# Altium schematic sheet MicroController.SchDoc: Teknofest Project
size 381 x 241 mm; Date: 21/12/2023; SheetNumber: 2; SheetTotal: 4; Prepared by: Mustafa Oğuz Ateş
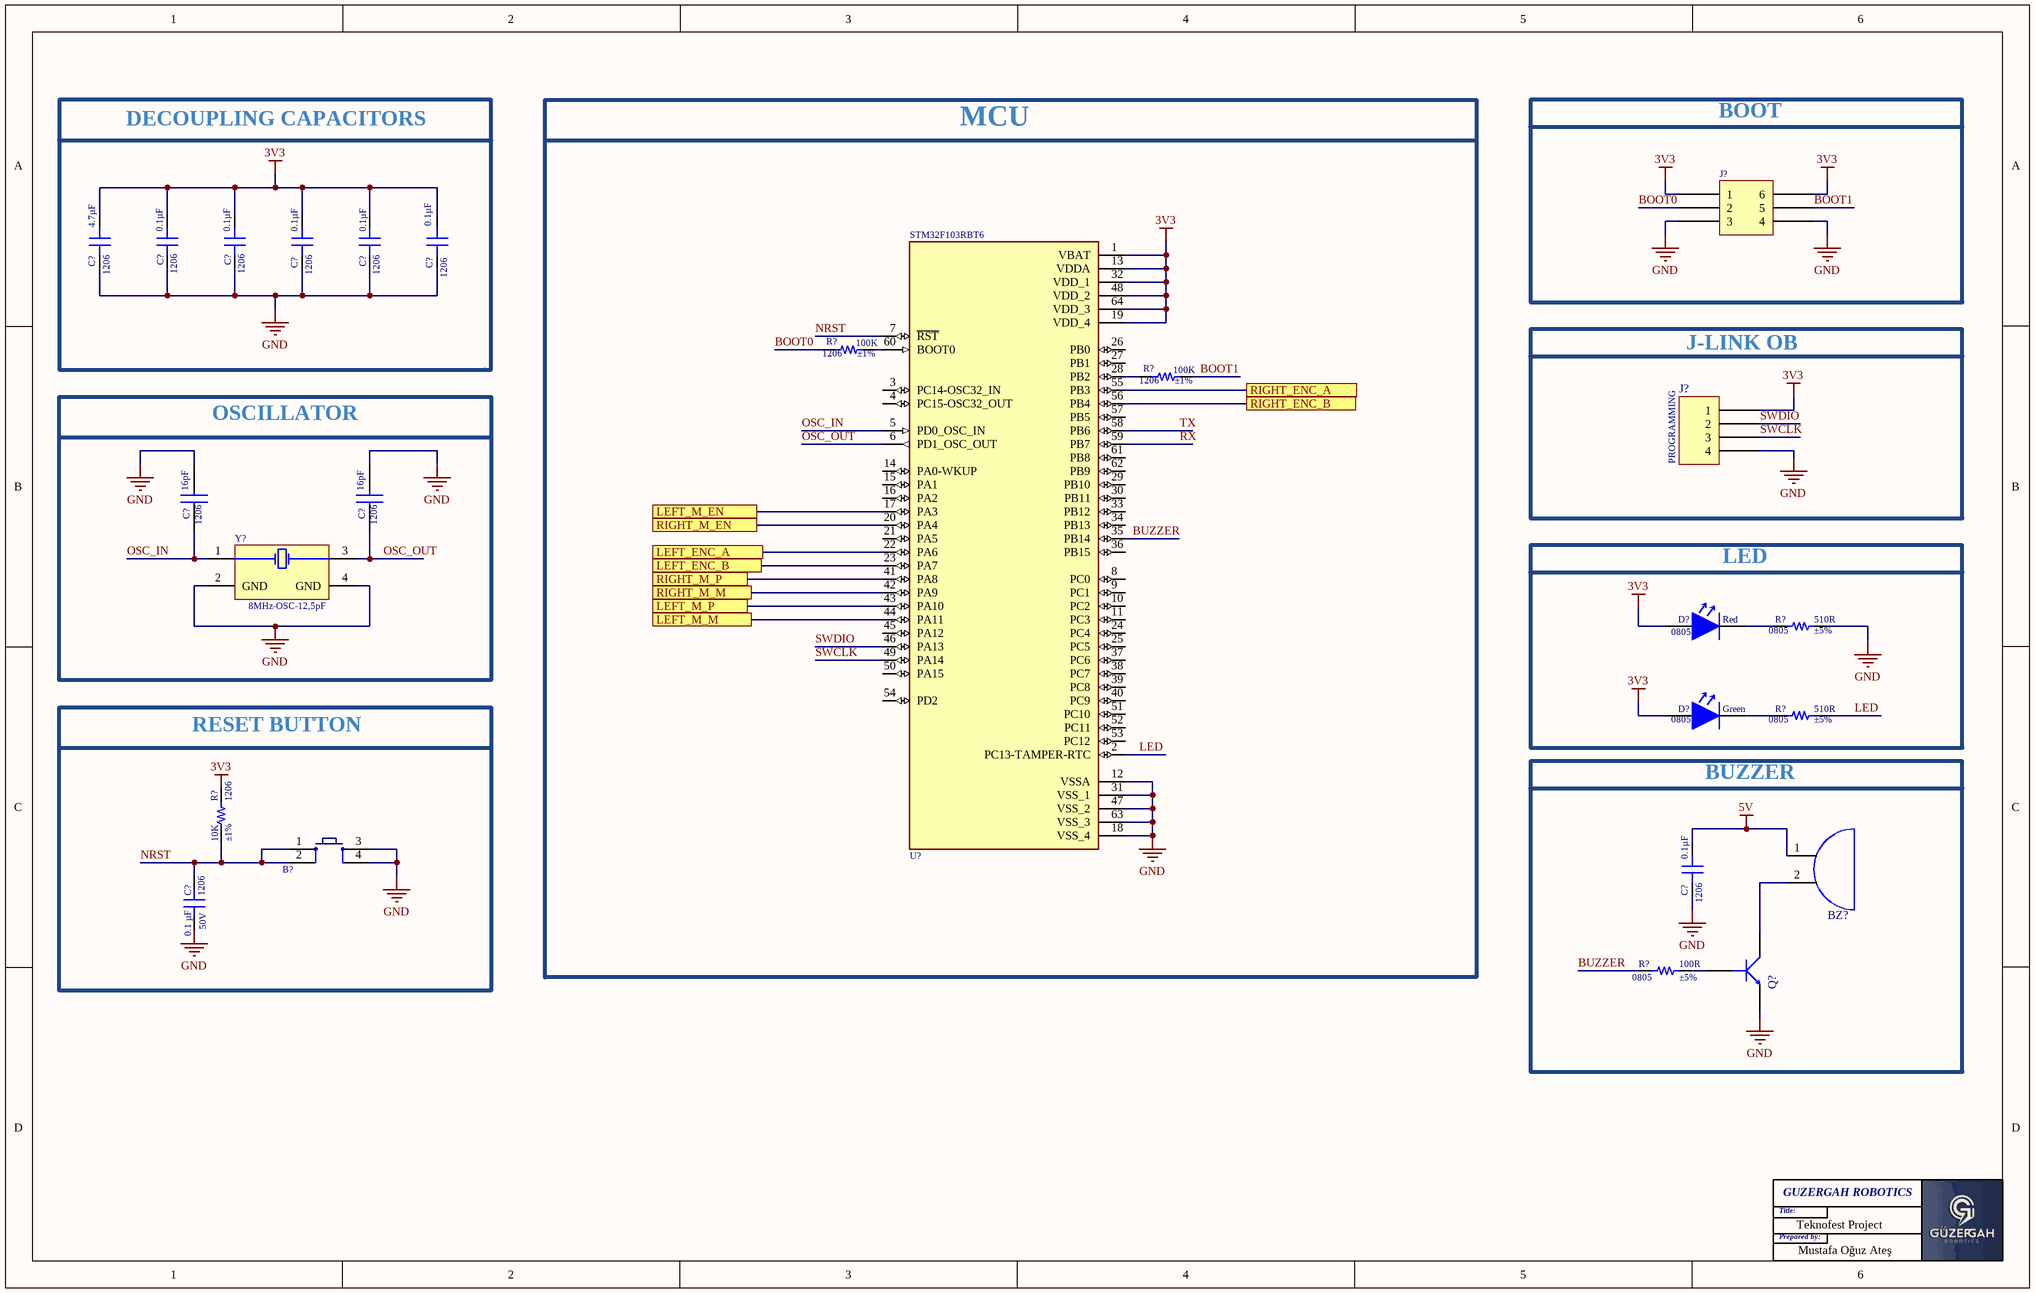
[diagram p0: MicroController.SchDoc]

## Parts
(Parts that share a designator on the sheet are numbered #1, #2 ... from top to bottom, then left to right.)
B?  Push Button  [PUSB BUTTON-SMD]  (value not drawn)
BZ?  CMI-9605IC-0580T  [CMI-9605IC]  (value not drawn)
C?#1  Package / Case: 1206  [CAP 1206_3216 - 1.0MM]  (hidden comment: 4.7µF)
C?#2  Package / Case: 1206  [CAP 1206_3216 - 1.0MM]  (hidden comment: 0.1µF)
C?#3  Package / Case: 1206  [CAP 1206_3216 - 1.0MM]  (hidden comment: 0.1µF)
C?#4  Package / Case: 1206  [CAP 1206_3216 - 1.0MM]  (hidden comment: 0.1µF)
C?#5  Package / Case: 1206  [CAP 1206_3216 - 1.0MM]  (hidden comment: 0.1µF)
C?#6  Package / Case: 1206  [CAP 1206_3216 - 1.0MM]  (hidden comment: 0.1µF)
C?#7  Parameter 1: 16pF  Device Package: 1206  [CAP_1206]
C?#8  Parameter 1: 16pF  Device Package: 1206  [CAP_1206]
C?#9  Package / Case: 1206  [CAP 1206_3216 - 1.0MM]  (hidden comment: 0.1µF)
C?#10  Package / Case: 1206  Voltage - Rated: 50V  [CAP 1206_3216 - 0.8MM]  (hidden comment: 0.1 µF)
D?#1  Color: Red  Case Code (Imperial): 0805  [LED_RED_0805]  (hidden comment: LH R974-LP-1)
D?#2  Case/Package: 0805  Color: Green  [LED_GREEN_0805]  (hidden comment: LTST-C171GKT)
J?#1  M20-7830342  [HARWIN M20-7830345]  (value not drawn)
J?#2  M20-7820442  [HARWIN M20-7820445]  (value not drawn)
Q?  MMBT3904-7-F  [SOT-23F]  (value not drawn)
R?#1  100K  Supplier Device Package: 1206  Tolerance: ±1%  [RES 1206_3216]
R?#2  100K  Supplier Device Package: 1206  Tolerance: ±1%  [RES 1206_3216]
R?#3  Supplier Device Package: 0805  Tolerance: ±5%  [RES 0805_2012]  (hidden comment: 510R)
R?#4  Supplier Device Package: 0805  Tolerance: ±5%  [RES 0805_2012]  (hidden comment: 510R)
R?#5  10K  Supplier Device Package: 1206  Tolerance: ±1%  [RES 1206_3216]
R?#6  Package / Case: 0805  Tolerance: ±5%  [RES 0805_2012]  (hidden comment: 100R)
U?  STM32F103RBT6  [LQFP-64]
Y?  8MHz-OSC-12,5pF  [8MHz-OSC]

## Blocks framed on the sheet
DECOUPLING CAPACITORS: C?#1-C?#6
BOOT: J?#1
MCU: R?#1 R?#2 U?
J-LINK OB: J?#2
LED: D?#1 D?#2 R?#3 R?#4
BUZZER: BZ? C?#9 Q? R?#6

## Ports
LEFT_ENC_A, LEFT_ENC_B, LEFT_M_EN, LEFT_M_M, LEFT_M_P, RIGHT_ENC_A, RIGHT_ENC_B, RIGHT_M_EN, RIGHT_M_M, RIGHT_M_P

## Nets
3V3: C?#1.2 C?#2.2 C?#3.2 C?#4.2 C?#5.2 C?#6.2 D?#1.2 D?#2.2 J?#1.1 J?#1.6 J?#2.1 R?#5.2 U?.1(VBAT) U?.13(VDDA) U?.19(VDD_4) U?.32(VDD_1) U?.48(VDD_2) U?.64(VDD_3)
5V: BZ?.1 C?#9.2
GND: B?.3 B?.4 C?#1.1 C?#2.1 C?#3.1 C?#4.1 C?#5.1 C?#6.1 C?#7.2 C?#8.2 C?#9.1 C?#10.2 J?#1.3 J?#1.4 J?#2.4 Q?.2(E) R?#3.2 U?.12(VSSA) U?.18(VSS_4) U?.31(VSS_1) U?.47(VSS_2) U?.63(VSS_3) Y?.2(GND) Y?.4(GND)
BOOT0: J?#1.2 R?#1.2
BOOT1: J?#1.5 R?#2.1
BUZZER: R?#6.1 U?.35(PB14)
LED: R?#4.2 U?.2(PC13-TAMPER-RTC)
LEFT_ENC_A: U?.22(PA6) ; port LEFT_ENC_A
LEFT_ENC_B: U?.23(PA7) ; port LEFT_ENC_B
LEFT_M_EN: U?.17(PA3) ; port LEFT_M_EN
LEFT_M_M: U?.44(PA11) ; port LEFT_M_M
LEFT_M_P: U?.43(PA10) ; port LEFT_M_P
NRST: B?.1 B?.2 C?#10.1 R?#5.1 U?.7(~{RST})
OSC_IN: C?#7.1 U?.5(PD0_OSC_IN) Y?.1(Tristate)
OSC_OUT: C?#8.1 U?.6(PD1_OSC_OUT) Y?.3(OUT)
RIGHT_ENC_A: U?.55(PB3) ; port RIGHT_ENC_A
RIGHT_ENC_B: U?.56(PB4) ; port RIGHT_ENC_B
RIGHT_M_EN: U?.20(PA4) ; port RIGHT_M_EN
RIGHT_M_M: U?.42(PA9) ; port RIGHT_M_M
RIGHT_M_P: U?.41(PA8) ; port RIGHT_M_P
RX: U?.59(PB7)
SWCLK: J?#2.3 U?.49(PA14)
SWDIO: J?#2.2 U?.46(PA13)
TX: U?.58(PB6)
NetBZ?_2: BZ?.2 Q?.3(C)
NetD?#1_1: D?#1.1 R?#3.1
NetD?#2_1: D?#2.1 R?#4.1
NetQ?_1: Q?.1(B) R?#6.2
NetR?#1_1: R?#1.1 U?.60(BOOT0)
NetR?#2_2: R?#2.2 U?.28(PB2)

Not connected (* = marked no-connect by the designer): U? 3(PC14-OSC32_IN) 4(PC15-OSC32_OUT) 8(PC0) 9(PC1) 10(PC2) 11(PC3) 14(PA0-WKUP) 15(PA1) 16(PA2) 21(PA5) 24(PC4) 25(PC5) 26(PB0) 27(PB1) 29(PB10) 30(PB11) 33(PB12) 34(PB13) 36(PB15) 37(PC6) 38(PC7) 39(PC8) 40(PC9) 45(PA12) 50(PA15) 51(PC10) 52(PC11) 53(PC12) 54(PD2) 57(PB5) 61(PB8) 62(PB9)

## Notes on the sheet
- OSCILLATOR
- (near J?#2) PROGRAMMING
- RESET BUTTON
- Title:
- Prepared by:
- GUZERGAH ROBOTICS

## Library data of the parts
B? = Push Button: Smd Push Button; Satın Alma Linki: https://urun.n11.com/diger/mini-pushbutton-switch-smd-P227461537?gclid=Cj0KCQjwkoDmBRCcARIsAG3xzl8Y_-jeD7HocNM6lvuZ_rVp83568XPGtNzlPwXWLph8oCRqo0yh87UaApZYEALw_wcB&gclsrc=aw.ds
BZ? = CMI-9605IC-0580T: Audio Buzzer Magnetic 3VDC 7VDC 30mA 5VDC 85dB 2600Hz to 2800Hz Through Hole Pin Box; Manufacturer: CUI Devices; Designed by: Mustafa; Supplier: Digi-Key; Supplier Part Number: 2223-CMI-9605IC-0580T-ND; Manufacturer Part Number: CMI-9605IC-0580T; RoHS: No; Category: Audio Products; Stock: 5910; Pricing: 1=1,22, 10=1,014, 25=0,938, 50=0,883, 100=0,8298, 250=0,76976, 500=0,71396, 1000=0,66741, 5000=0,65403 (USD); Case/Package: CMI-9605IC
C?#1 = 1206ZC475MAT2A: CAP CER 4.7UF 10V X7R 1206; manufacturer: AVX Corporation; Tolerance: ±20%; Part Number: 1206ZC475MAT2A; Value: 4.7µF; Applications: General Purpose; Capacitance: 4.7µF; componentlink1description: Datasheet; componentlink1url: http://datasheets.avx.com/X7RDielectric.pdf; componentlink2description: DigiKey Link; componentlink2url: http://digikey.com/product-detail/en/avx-corporation/1206ZC475MAT2A/478-12250-1-ND/9565657; Device Package: 1206 (3216 Metric); lastupdated: 2.09.2020 01:05:04; Lifecycle Status: Active; Minimum Order: 1; Mounting Type: Surface Mount, MLCC; Operating Temperature: -55°C ~ 125°C; packaging: TapeAndReel; partid: 19450; Part Status: Active; price: 0.08; series: -; Size / Dimension: 0.126" L x 0.063" W (3.20mm x 1.60mm); Supplier 1: DigiKey; Supplier Part Number 1: 478-12250-1-ND; Temperature Coefficient: X7R; Thickness (Max): 0.037" (0.94mm); Voltage - Rated: 10V
C?#2-C?#6 C?#9 = 1206ZC475MAT2A: CAP CER 4.7UF 10V X7R 1206; manufacturer: AVX Corporation; Capacitance: 40.1µF; Tolerance: ±20%; Part Number: 1206ZC475MAT2A; Value: 0.1µF; Applications: General Purpose; componentlink1description: Datasheet; componentlink1url: http://datasheets.avx.com/X7RDielectric.pdf; componentlink2description: DigiKey Link; componentlink2url: http://digikey.com/product-detail/en/avx-corporation/1206ZC475MAT2A/478-12250-1-ND/9565657; Device Package: 1206 (3216 Metric); lastupdated: 2.09.2020 01:05:04; Lifecycle Status: Active; Minimum Order: 1; Mounting Type: Surface Mount, MLCC; Operating Temperature: -55°C ~ 125°C; packaging: TapeAndReel; partid: 19450; Part Status: Active; price: 0.08; series: -; Size / Dimension: 0.126" L x 0.063" W (3.20mm x 1.60mm); Supplier 1: DigiKey; Supplier Part Number 1: 478-12250-1-ND; Temperature Coefficient: X7R; Thickness (Max): 0.037" (0.94mm); Voltage - Rated: 10V
C?#7 C?#8 = CAP CER 16pF 1206: Value: 16pF; Capacitance: 16pF
C?#10 = CC1206MRY5V9BB104: CAP CER 0.1UF 50V Y5V 1206; manufacturer: Yageo; Temperature Coefficient: Y5V (F); Tolerance: ±20%; Part Number: CC1206MRY5V9BB104; Value: 0.1 µF; Applications: General Purpose; Capacitance: 0.1 µF; componentlink1description: Datasheet; componentlink1url: http://www.yageo.com/documents/recent/UPY-GPHC_Y5V_6.3V-to-50V_8.pdf; componentlink2description: DigiKey Link; componentlink2url: https://www.digikey.com/en/products/detail/yageo/CC1206MRY5V9BB104/5884674; Device Package: 1206 (3216 Metric); lastupdated: 24.12.2023 20:16:49; Lifecycle Status: Active; Minimum Order: 1; Mounting Type: Surface Mount, MLCC; Operating Temperature: -30°C ~ 85°C; packaging: TapeAndReel; partid: 18711; Part Status: Active; price: 0.04; series: CC; Size / Dimension: 0.126" L x 0.063" W (3.20mm x 1.60mm); Supplier 1: DigiKey; Supplier Part Number 1: 311-4504-1-ND; Thickness (Max): 0.028" (0.70mm)
D?#1 = LED RED 0805: LED Uni-Color Hyper Red 660nm 2-Pin Chip 0805(2012Metric) T/R; Manufacturer: Osram Opto; Lens Color: White; Forward Voltage: 1.8V; Lens Style: Diffused,Flat,Colorless; Luminous Intensity: 71mcd; Viewing Angle: 160°; Forward Current: 30mA; Dominant Wavelength: 645nm; Number of Elements: 1; Test Current: 20mA; Reverse Voltage: 5V; Lens Transparency: Diffused; Luminous Flux: 0.17lm; Lens Size: 1.25mm; Designed by: Mustafa; Supplier 1: Digi-Key; Manufacturer Part Number: LH R974-LP-1; RoHS: Yes; Category: LEDs; Stock 1: 35632; Pricing 1: 1=0,26000, 10=0,13900, 100=0,06480, 500=0,05978, 1000=0,04683, 2000=0,04584 (USD); Mount: Surface Mount; Case/Package: 0805; Number of Pins: 2; Case Code (Metric): 2012; Min Operating Temperature: -30°C; Max Operating Temperature: 85°C; Packaging: Tape and Reel; Illumination Color: Red; Package Quantity: 1; Series: CHipLED; Length: 2.1mm; Width: 1.25mm; Depth: 1.35mm; Radiation Hardening: No; RoHS Compliant: Yes; ComponentLink1URL: http://www.jameco.com/Jameco/Products/ProdDS/2085634.pdf?src-supplier=Jameco; ComponentLink1Description: http://www.jameco.com/Jameco/Products/ProdDS/2085634.pdf?src-supplier=Jameco; ComponentLink2URL: http://components.arrow.com/part/dataview/0323_01825492?src-supplier=Arrow+Europe; ComponentLink2Description: http://components.arrow.com/part/dataview/0323_01825492?src-supplier=Arrow+Europe; ComponentLink3URL: https://dammedia.osram.info/media/resource/hires/osram-dam-2493888/LH%20R974.pdf?src-supplier=Digi-Key; ComponentLink3Description: https://dammedia.osram.info/media/resource/hires/osram-dam-2493888/LH%20R974.pdf?src-supplier=Digi-Key; ComponentLink4URL: http://www.mouser.com/ds/2/311/LH%20R974%20-%20CHIPLED%200805-318659.pdf?src-supplier=Mouser; ComponentLink4Description: http://www.mouser.com/ds/2/311/LH%20R974%20-%20CHIPLED%200805-318659.pdf?src-supplier=Mouser; ComponentLink5URL: https://www.verical.com/server-webapp/html/getDatasheet?partID=258950&src-supplier=Verical; ComponentLink5Description: https://www.verical.com/server-webapp/html/getDatasheet?partID=258950&src-supplier=Verical; ComponentLink6URL: http://components.arrow.com/part/dataview/41971690S1077610N9133?src-supplier=Arrow+Electronics; ComponentLink6Description: http://components.arrow.com/part/dataview/41971690S1077610N9133?src-supplier=Arrow+Electronics; ComponentLink7URL: http://components.arrow.com/part/dataview/41971690S6190115N2128?src-supplier=Arrow+Electronics; ComponentLink7Description: http://components.arrow.com/part/dataview/41971690S6190115N2128?src-supplier=Arrow+Electronics; Supplier Part Number 1: 475-1415-1-ND
D?#2 = LED GREEN 0805: Green 0805 130 º Min 5 mcd Typical 12 mcd Water Clear Lens SMT LED; Manufacturer: Vishay Lite-On; Designed by: Mustafa; Lens Color: Colorless; Viewing Angle: 130°; Lens Style: Diffused,Colorless,Rectangular,Clear; Luminous Intensity: 12mcd; Forward Current: 30mA; Forward Voltage: 2.1V; Power Rating: 100mW; Dominant Wavelength: 569nm; Test Current: 10mA; Number of Elements: 1; Wavelength: 585nm; Reverse Voltage: 5V; Supplier 1: Digi-Key; Manufacturer Part Number: LTST-C171GKT; RoHS: Yes; Category: LEDs; Stock 1: 159023; Pricing 1: 1=0,26000, 10=0,14100, 100=0,06560, 500=0,06060, 1000=0,04747 (USD); Mount: Surface Mount; Number of Pins: 2; Case Code (Metric): 2012; Case Code (Imperial): 0805; Min Operating Temperature: -55°C; Max Operating Temperature: 85°C; Package Quantity: 1; Packaging: Tape and Reel; Illumination Color: Green; Lens Transparency: Clear; Power Dissipation: 100mW; Number of LEDs: 1; Series: CHIPLED 0805; Length: 2mm; Width: 1.25mm; Height: 0.8mm; Depth: 1.25mm; Radiation Hardening: No; Lead Free: Lead Free; RoHS Compliant: Yes; ComponentLink1URL: https://datasheet.ciiva.com/2110/ltst-c171gkt-2110000.pdf?src-supplier=Digi-Key; ComponentLink1Description: https://datasheet.ciiva.com/2110/ltst-c171gkt-2110000.pdf?src-supplier=Digi-Key; ComponentLink2URL: https://datasheet.ciiva.com/11773/0900766b80dc0296-11773991.pdf?src-supplier=RSComponents; ComponentLink2Description: https://datasheet.ciiva.com/11773/0900766b80dc0296-11773991.pdf?src-supplier=RSComponents; ComponentLink3URL: https://datasheet.ciiva.com/12400/lite-on-ltst-c171gkt-190133-12400647.pdf?src-supplier=Mouser; ComponentLink3Description: https://datasheet.ciiva.com/12400/lite-on-ltst-c171gkt-190133-12400647.pdf?src-supplier=Mouser; ComponentLink4URL: https://datasheet.ciiva.com/2110/ltst-c171gkt-2110001.pdf?src-supplier=Digi-Key; ComponentLink4Description: https://datasheet.ciiva.com/2110/ltst-c171gkt-2110001.pdf?src-supplier=Digi-Key; ComponentLink5URL: https://datasheet.ciiva.com/2110/ltst-c171gkt-2110002.pdf?src-supplier=Digi-Key; ComponentLink5Description: https://datasheet.ciiva.com/2110/ltst-c171gkt-2110002.pdf?src-supplier=Digi-Key; ComponentLink6URL: https://datasheet.ciiva.com/16396/ltst-c171gkt-16396549.pdf?src-supplier=Future+Electronics; ComponentLink6Description: https://datasheet.ciiva.com/16396/ltst-c171gkt-16396549.pdf?src-supplier=Future+Electronics; Supplier Part Number 1: 160-1423-1-ND
J?#1 = M20-7830342: CONN RCPT 6POS 0.1 GOLD PCB; Part Number: M20-7830342
J?#2 = M20-7820442: CONN RCPT 4POS 0.1 GOLD PCB; Part Number: M20-7820442
Q? = MMBT3904-7-F: Transistor General Purpose BJT NPN 40 Volt 0.2A Automotive 3-Pin SOT-23; Manufacturer: Diodes Zetex; Designed by: BERK; Max Power Dissipation: 300mW; Collector Emitter Voltage (VCEO): 40V; Max Collector Current: 200mA; Collector Base Voltage (VCBO): 60V; Frequency: 300MHz; hFE Min: 100; Number of Elements: 1; Emitter Base Voltage (VEBO): 6V; Collector Emitter Saturation Voltage: 300mV; Power Dissipation: 350mW; Element Configuration: Single; Supplier 1: Digi-Key; Manufacturer Part Number: MMBT3904-7-F; RoHS: Yes; Category: BJTs; Stock 1: 2393281; Pricing 1: 1=0,12000, 10=0,08600, 25=0,08280, 100=0,04660, 500=0,03664, 1000=0,02544 (USD); Mount: Surface Mount; Case/Package: SOT-23; Number of Pins: 3; Weight: 0.000282oz; Contact Plating: Tin,Matte; Min Operating Temperature: -55°C; Max Operating Temperature: 150°C; Polarity: NPN; Packaging: Tape and Reel; Package Quantity: 3000; Transition Frequency: 300MHz; Collector Emitter Breakdown Voltage: 40V; Max Breakdown Voltage: 40V; Continuous Collector Current: 200mA; Max Frequency: 300MHz; Gain Bandwidth Product: 300MHz; Series: -; Collector-emitter Voltage-Max: 300mV; Voltage Rating (DC): 40V; Length: 3.05mm; Width: 1.4mm; Height: 1mm; Radiation Hardening: No; REACH SVHC: No SVHC; Lead Free: Lead Free; RoHS Compliant: Yes; ComponentLink1URL: https://datasheet.ciiva.com/11201/ds30036-11201778.pdf?src-supplier=Avnet; ComponentLink1Description: https://datasheet.ciiva.com/11201/ds30036-11201778.pdf?src-supplier=Avnet; ComponentLink2URL: https://datasheet.ciiva.com/15138/getdatasheetpartid-53265-15138780.pdf?src-supplier=Verical; ComponentLink2Description: https://datasheet.ciiva.com/15138/getdatasheetpartid-53265-15138780.pdf?src-supplier=Verical; ComponentLink3URL: https://datasheet.ciiva.com/6361/ds30036-6361254.pdf?src-supplier=Digi-Key; ComponentLink3Description: https://datasheet.ciiva.com/6361/ds30036-6361254.pdf?src-supplier=Digi-Key; ComponentLink4URL: https://datasheet.ciiva.com/22711/1915516-22711750.pdf?src-supplier=Element14; ComponentLink4Description: https://datasheet.ciiva.com/22711/1915516-22711750.pdf?src-supplier=Element14; ComponentLink5URL: https://datasheet.ciiva.com/11198/ds30036-11198999.pdf?src-supplier=Avnet; ComponentLink5Description: https://datasheet.ciiva.com/11198/ds30036-11198999.pdf?src-supplier=Avnet; ComponentLink6URL: https://datasheet.ciiva.com/6361/ds30036-6361256.pdf?src-supplier=Digi-Key; ComponentLink6Description: https://datasheet.ciiva.com/6361/ds30036-6361256.pdf?src-supplier=Digi-Key; Supplier Part Number 1: MMBT3904-FDIDKR-ND
R?#1 R?#2 R?#5 = CR1206AFX-1002EAS: RESA-AS 1206 10K 1% 250MW TC100; Manufacturer: Bourns Inc.; Power (Watts): 0.25W, 1/4W; Temperature Coefficient: ±100ppm/°C; Part Number: CR1206AFX-1002EAS; ComponentLink1Description: Datasheet; ComponentLink1URL: //media.digikey.com/pdf/Data%20Sheets/Bourns%20PDFs/CRyyyyA-AS_Model_DS.pdf; ComponentLink2Description: DigiKey Link; ComponentLink2URL: https://www.digikey.com/en/products/detail/bourns-inc/CR1206AFX-1002EAS/10240135; Composition: Thick Film; Device Package: 1206 (3216 Metric); Features: Anti-Sulfur, Automotive AEC-Q200, Moisture Resistant; Height - Seated (Max): 0.026" (0.65mm); LastUpdated: 25.12.2023 20:50:47; Lifecycle Status: Active; Minimum Order: 1; Number of Terminations: 2; Operating Temperature: -55°C ~ 155°C; Package / Case: 1206 (3216 Metric); Packaging: TapeAndReel; PartId: 26960; Part Status: Active; Price: 0.01; Ratings: AEC-Q200; Series: CR1206A-AS; Size / Dimension: 0.122" L x 0.061" W (3.10mm x 1.55mm); Supplier 1: DigiKey; Supplier Part Number 1: 118-CR1206AFX-1002EASCT-ND
  R?#1 R?#2: Resistance: 100k; Value: 100K
  R?#5: Resistance: 10K; Value: 10K
R?#3 R?#4 R?#6 = ERJ-6GEYJ331V: RES SMD 330 OHM 5% 1/8W 0805; Manufacturer: Panasonic Electronic Components; Power (Watts): 0.125W, 1/8W; Temperature Coefficient: ±200ppm/°C; Part Number: ERJ-6GEYJ331V; ComponentLink1Description: Datasheet; ComponentLink1URL: http://industrial.panasonic.com/www-cgi/jvcr13pz.cgi?E+PZ+3+AOA0001+ERJ6GEYJ331V+7+WW; ComponentLink2Description: DigiKey Link; ComponentLink2URL: https://www.digikey.com/en/products/detail/panasonic-electronic-components/ERJ-6GEYJ331V/89726; Composition: Thick Film; Device Package: 0805 (2012 Metric); Features: Automotive AEC-Q200; Height - Seated (Max): 0.028" (0.70mm); LastUpdated: 6.02.2024 21:02:13; Lifecycle Status: Active; Minimum Order: 1; Number of Terminations: 2; Operating Temperature: -55°C ~ 155°C; Packaging: TapeAndReel; PartId: 30017; Part Status: Active; Price: 0.01; Ratings: AEC-Q200; Series: ERJ-6G; Size / Dimension: 0.079" L x 0.049" W (2.00mm x 1.25mm); Supplier 1: DigiKey; Supplier Part Number 1: P330ACT-ND
  R?#3 R?#4: Value: 510R; Package / Case: 0805 (2012 Metric); Resistance: 510R
  R?#6: Value: 100R; Resistance: 100R; Supplier Device Package: 0805
U? = STM32F103RBT6: STM32F103RTB6 LQFP-64; MF: STMicroelectronics; Designed by: Mustafa Oğuz Ateş; Package: LQFP-64 STMicroelectronics; Price: None; Check_prices: https://www.snapeda.com/parts/STM32F103RBT6/STMicroelectronics/view-part/?ref=eda; Value: *; SnapEDA_Link: https://www.snapeda.com/parts/STM32F103RBT6/STMicroelectronics/view-part/?ref=snap; MP: STM32F103RBT6; Availability: In Stock; Purchase-URL: https://pricing.snapeda.com/search?q=STM32F103RBT6&ref=eda
Y? = OSI-8MHz: CRYSTAL 8MHZ 12.5pF SMD TR RALTRON; Frequency Tolerance: ±20PPM; Frequency Stability: ±15PPM; Equivalent Series Resistance (ESR): 100 Ohms; Frequency: 8MHz; Capacitance: 12.5pF; Operating Temperature: -40°C~+85°C; Dimensions (mm): 3.20x2.50x0.70; Packaging: TAPE&REEL; Package / Case: 4-SMD; Series: RH100; Manufacturer: RALTRON; Mounting Type: SMT